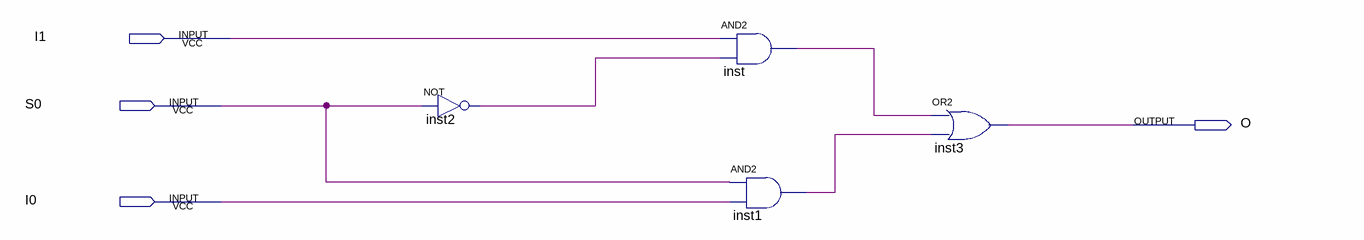
[diagram p0: schematic sheet]
// Quartus schematic MUX_21.bdf as structural Verilog: 4 symbols, 4 pins
module MUX_21 (
  input  I1,
  input  S0,
  input  I0,
  output O
);

  wire inst1_out, inst2_out, inst_out;

  not inst2 (inst2_out, S0);
  and inst (inst_out, I1, inst2_out);
  and inst1 (inst1_out, S0, I0);
  or inst3 (O, inst_out, inst1_out);
endmodule
